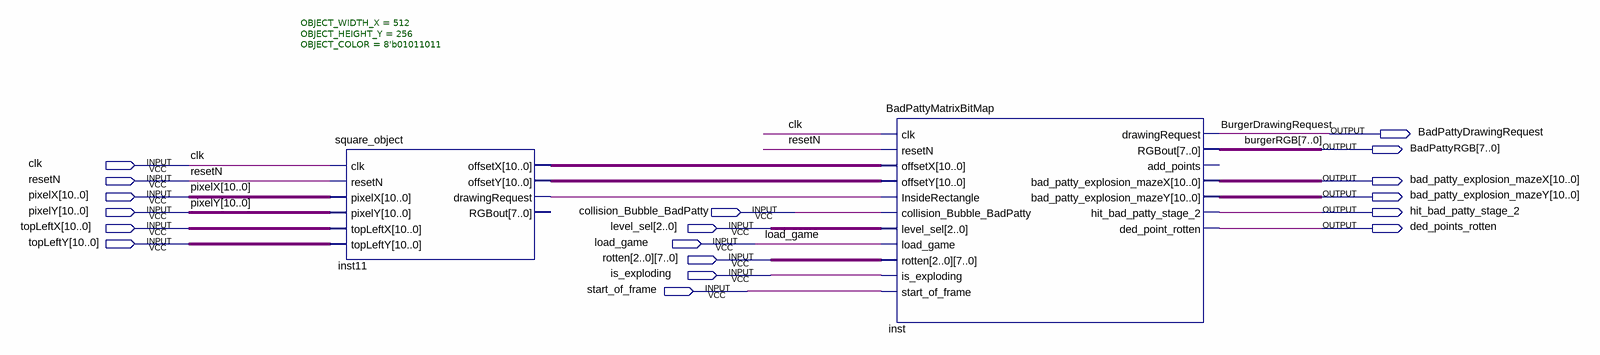
[diagram p0: schematic sheet]
// Quartus schematic BadPattyDisplay.bdf as structural Verilog: 2 symbols, 18 pins
module BadPattyDisplay (
  input  clk,
  input  resetN,
  input  [10:0] pixelX,
  input  [10:0] pixelY,
  input  collision_Bubble_BadPatty,
  input  [10:0] topLeftX,
  input  [2:0] level_sel,
  input  [10:0] topLeftY,
  input  load_game,
  input  [7:0] rotten_2,
  input  [7:0] rotten_1,
  input  [7:0] rotten_0,
  input  is_exploding,
  input  start_of_frame,
  output BadPattyDrawingRequest,
  output [7:0] BadPattyRGB,
  output [10:0] bad_patty_explosion_mazeX,
  output [10:0] bad_patty_explosion_mazeY,
  output hit_bad_patty_stage_2,
  output ded_points_rotten
);

  wire inst11_drawingrequest;
  wire [10:0] inst11_offsetx, inst11_offsety;

  square_object #(.OBJECT_WIDTH_X(512), .OBJECT_HEIGHT_Y(256), .OBJECT_COLOR(8'b01011011)) inst11 (
    .clk(clk), .resetN(resetN), .pixelX(pixelX), .pixelY(pixelY), .topLeftX(topLeftX), .topLeftY(topLeftY),
    .offsetX(inst11_offsetx), .offsetY(inst11_offsety), .drawingRequest(inst11_drawingrequest));  // open: RGBout
  BadPattyMatrixBitMap inst (
    .clk(clk), .resetN(resetN), .offsetX(inst11_offsetx), .offsetY(inst11_offsety),
    .InsideRectangle(inst11_drawingrequest), .collision_Bubble_BadPatty(collision_Bubble_BadPatty),
    .level_sel(level_sel), .load_game(load_game), .rotten({rotten_2, rotten_1, rotten_0}),
    .is_exploding(is_exploding), .start_of_frame(start_of_frame), .drawingRequest(BadPattyDrawingRequest),
    .RGBout(BadPattyRGB), .bad_patty_explosion_mazeX(bad_patty_explosion_mazeX),
    .bad_patty_explosion_mazeY(bad_patty_explosion_mazeY), .hit_bad_patty_stage_2(hit_bad_patty_stage_2),
    .ded_point_rotten(ded_points_rotten));  // open: add_points

  // Other names for the same wires on the sheet: BurgerDrawingRequest = BadPattyDrawingRequest;
  //   burgerRGB[7:0] = BadPattyRGB
endmodule
